# Altium schematic sheet Signal_Processing.SchDoc
size A4
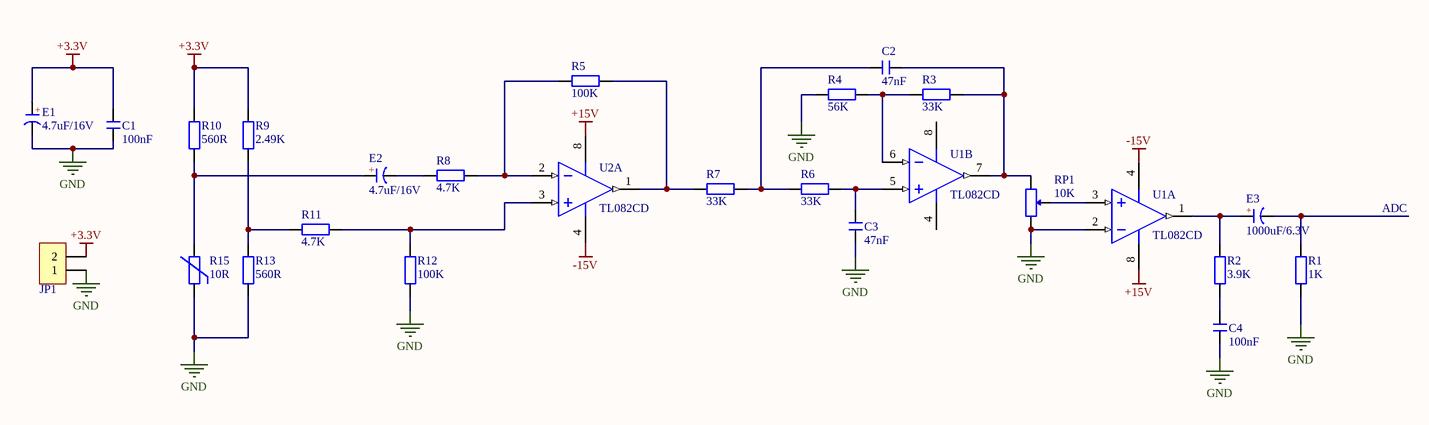
[diagram p0: Signal_Processing.SchDoc]

## Parts
C1  100nF  [C 0603_L]
C2  47nF  [C 0603_L]
C3  47nF  [C 0603_L]
C4  100nF  [C 0603_L]
E1  4.7uF/16V  [CD A(3216)]
E2  4.7uF/16V  [CD A(3216)]
E3  1000uF/6.3V  [CD E(7343H)]
JP1  HDR-1X2  [HDR2.54-LI-2P]  (value not drawn)
R1  1K  [R 0603_L]
R2  3.9K  [R 0603_L]
R3  33K  [R 0603_L]
R4  56K  [R 0603_L]
R5  100K  [R 0603_L]
R6  33K  [R 0603_L]
R7  33K  [R 0603_L]
R8  4.7K  [R 0603_L]
R9  2.49K  [R 0603_L]
R10  560R  [R 0603_L]
R11  4.7K  [R 0603_L]
R12  100K  [R 0603_L]
R13  560R  [R 0603_L]
R15  10R  [VDR 9D-4.5]
RP1  10K  [3296W]
U1  TL082CD  [TI-D8_N]  (parts A,B of 2)
U2  TL082CD  [TI-D8_N]  (part A of 2)

## Nets
+3.3V: C1.2 E1.1(A) JP1.2 R9.1 R10.2
+15V: U1.8(VCC+) U2.8(VCC+)
-15V: U1.4(VCC-) U2.4(VCC-)
GND: C1.1 C3.1 C4.1 E1.2(K) JP1.1 R1.1 R4.1 R12.1 R13.1 R15.1 RP1.3 U1.2(IN1-)
NetC2_1: C2.1 R6.1 R7.2
NetC2_2: C2.2 R3.2 RP1.1 U1.7(OUT2)
NetC3_2: C3.2 R6.2 U1.5(IN2+)
NetC4_2: C4.2 R2.1
NetE2_1: E2.1(A) R10.1 R15.2
NetE2_2: E2.2(K) R8.1
NetE3_1: E3.1(A) R2.2 U1.1(OUT1)
NetE3_2: E3.2(K) R1.2
NetR3_1: R3.1 R4.2 U1.6(IN2-)
NetR5_1: R5.1 R8.2 U2.2(IN1-)
NetR5_2: R5.2 R7.1 U2.1(OUT1)
NetR9_2: R9.2 R11.1 R13.2
NetR11_2: R11.2 R12.2 U2.3(IN1+)
NetRP1_2: RP1.2 U1.3(IN1+)

## Notes on the sheet
- ADC
- (in symbol CT) +

## Library data of the parts
C1-C4 = C: 贴片电容; BOM名称: 无极性贴片电容; 淘宝ID: 封装库来自淘宝 ID：黄晶宝石; 联系售后，技术支持: https://shop463601444.taobao.com; 唯一出售店铺网址: https://shop463601444.taobao.com
E1-E3 = CT: 贴片钽电容; 淘宝ID: 封装库来自淘宝 ID：黄晶宝石; BOM名称: 贴片钽电容; 联系售后: https://shop463601444.taobao.com
JP1 = Header 2: 2P接插件; 版权归属: 封装库来自淘宝 ID：黄晶宝石; BOM名称: 2P接插件; 联系售后: https://shop463601444.taobao.com
R1-R13 = R: 贴片电阻; 版权归属: 来自淘宝 ID：黄晶宝石; 封装库来自淘宝卖家 ID：黄晶宝石: 其他店铺购入均为盗版，不享受售后技术支持服务，请立即申请退款; BOM名称: 贴片电阻; 联系售后: https://shop463601444.taobao.com
R15 = R_VSR: 压敏电阻; 版权归属: 封装库来自淘宝 ID：黄晶宝石; BOM名称: 压敏电阻; 联系售后: https://shop463601444.taobao.com
RP1 = RP: 单联电位器; BOM名称: 插件电位器; 版权归属: 封装库来自淘宝 ID：黄晶宝石; 联系售后: https://shop463601444.taobao.com
U1 U2 = TL082CD: JFET-Input Operational Amplifier, 7 to 36 V, 0 to 70 degC, 8-pin SOIC (D8), Green (RoHS & no Sb/Br); Manufacturer: Texas Instruments; CMRR(Min)(dB): 70; GBW(Typ)(MHz): 3; IIB(Max)(pA): 400; Iq per channel(Max)(mA): 2.8; Number of Channels: 2; Offset Drift(Typ)(uV/C): 18; Rating: Catalog; Slew Rate(Typ)(V/us): 13; Sub Family: General Purpose Amplifier, High Supply Voltage Amplifier (>=30V); Total Supply Voltage(Max)(+5V is 5, +/-5V is 10): 36; Total Supply Voltage(Min)(+5V is 5, +/-5V is 10): 7; Vio (25C)(Max)(mV): 15; DatasheetVersion: SLOS081G; PackageVersion: 4040047-3/M, 06/2011; PackageReference: D8; PackageDescription: 8-Pin Plastic Small Outline, Body 4.9 x 3.9 mm, Pitch 1.27 mm; Supplier 1: Digi-Key; Supplier Part Number 1: 296-1284-5-ND; Supplier 2: Farnell; Supplier Part Number 2: 1103183; Supplier 3: Newark; Supplier Part Number 3: 35K1261; Supplier 4: Mouser; Supplier Part Number 4: 595-TL082CD; Eco-Plan: Green (RoHS & no Sb/Br); Vn at 1kHz(Typ)(nV/rtHz): 18; Mounting Technology: Surface Mount; Code_JEDEC: MS-012; PartNumber: TL082CD; ComponentLink1Description: Manufacturer URL; ComponentLink1URL: http://www.ti.com/; ComponentLink2Description: Datasheet; ComponentLink2URL: http://www.ti.com/lit/ds/symlink/tl082.pdf; ComponentLink3Description: Package Specification; ComponentLink3URL: http://www.ti.com/litv/pdf/msoi002j